# Altium schematic sheet ble.SchDoc
size A4
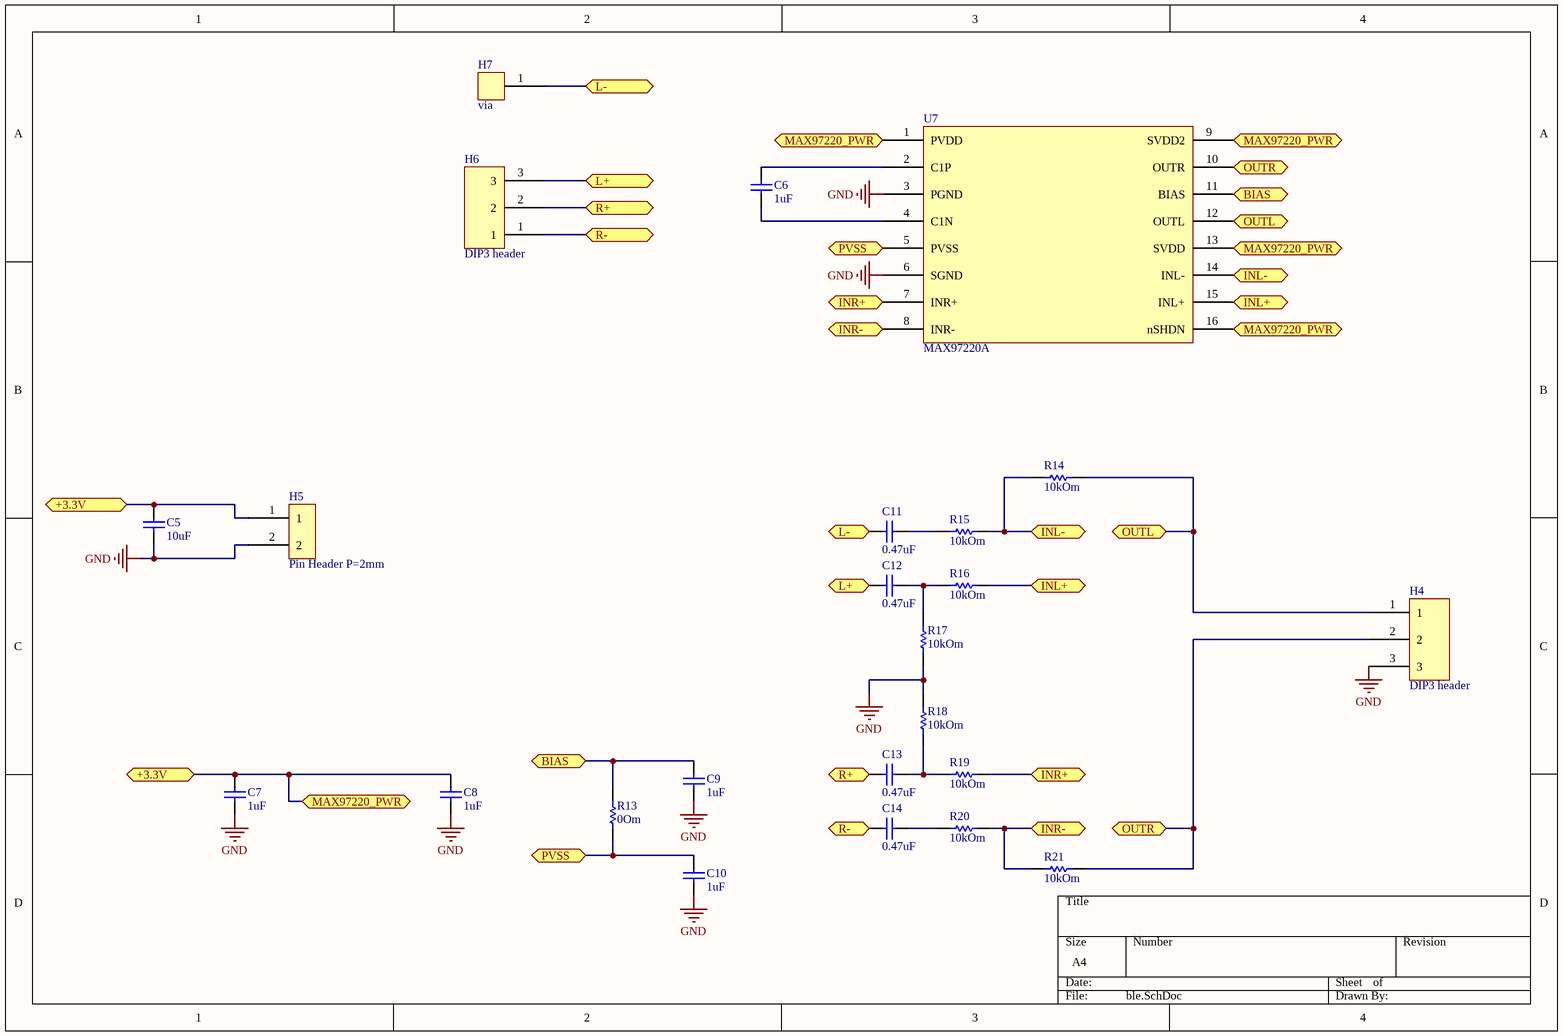
[diagram p0: ble.SchDoc]

## Parts
C5  10uF  [CAPC1608X90X35ML10T15]
C6  1uF  [CAPC1608X90X35ML10T15]
C7  1uF  [CAPC1608X90X35ML10T15]
C8  1uF  [CAPC1608X90X35ML10T15]
C9  1uF  [CAPC1608X90X35ML10T15]
C10  1uF  [CAPC1608X90X35ML10T15]
C11  0.47uF  [CAPC1608X90X35ML10T15]
C12  0.47uF  [CAPC1608X90X35ML10T15]
C13  0.47uF  [CAPC1608X90X35ML10T15]
C14  0.47uF  [CAPC1608X90X35ML10T15]
H4  DIP3 header  [DIP3]
H5  Pin Header P=2mm  [Pin Header P=2mm]
H6  DIP3 header  [DIP3]
H7  via  [via]
R13  0Om  [RESC1608X55X30ML20T10]
R14  10kOm  [RESC1608X55X30ML20T10]
R15  10kOm  [RESC1608X55X30ML20T10]
R16  10kOm  [RESC1608X55X30ML20T10]
R17  10kOm  [RESC1608X55X30ML20T10]
R18  10kOm  [RESC1608X55X30ML20T10]
R19  10kOm  [RESC1608X55X30ML20T10]
R20  10kOm  [RESC1608X55X30ML20T10]
R21  10kOm  [RESC1608X55X30ML20T10]
U7  MAX97220A  [MAX97220A]

## Ports
+3.3V (bidir), BIAS (bidir), INL+ (bidir), INL- (bidir), INR+ (bidir), INR- (bidir), L+ (bidir), L- (bidir), MAX97220_PWR (bidir), OUTL (bidir), OUTR (bidir), PVSS (bidir), R+ (bidir), R- (bidir)

## Nets
GND: C5.1 C7.1 C8.1 C9.1 C10.1 H4.3 H5.2 R17.1 R18.2 U7.3(PGND) U7.6(SGND)
+3.3V: C5.2 C7.2 C8.2 H5.1 U7.1(PVDD) U7.9(SVDD2) U7.13(SVDD) U7.16(nSHDN) ; port +3.3V, port MAX97220_PWR
BIAS: C9.2 R13.2 U7.11(BIAS) ; port BIAS
INL+: R16.2 U7.15(INL+) ; port INL+
INL-: R14.1 R15.2 U7.14(INL-) ; port INL-
INR+: R19.2 U7.7(INR+) ; port INR+
INR-: R20.2 R21.1 U7.8(INR-) ; port INR-
L+: C12.1 H6.3 ; port L+
L-: C11.1 H7.1 ; port L-
OUTL: H4.1 R14.2 U7.12(OUTL) ; port OUTL
OUTR: H4.2 R21.2 U7.10(OUTR) ; port OUTR
PVSS: C10.2 R13.1 U7.5(PVSS) ; port PVSS
R+: C13.1 H6.2 ; port R+
R-: C14.1 H6.1 ; port R-
NetC6_1: C6.1 U7.4(C1N)
NetC6_2: C6.2 U7.2(C1P)
NetC11_2: C11.2 R15.1
NetC12_2: C12.2 R16.1 R17.2
NetC13_2: C13.2 R18.1 R19.1
NetC14_2: C14.2 R20.1

## Library data of the parts
C5-C14 = CMP-2006-02335-1: Manufacturer: Murata; Part Number: GCM1885C2A101JA16D
R13-R21 = CMP-2000-01555-1: Part Number: RK73H1JTTD5101F; Manufacturer: KOA Speer